# EAGLE schematic odrs (EAGLE 9.6.0)
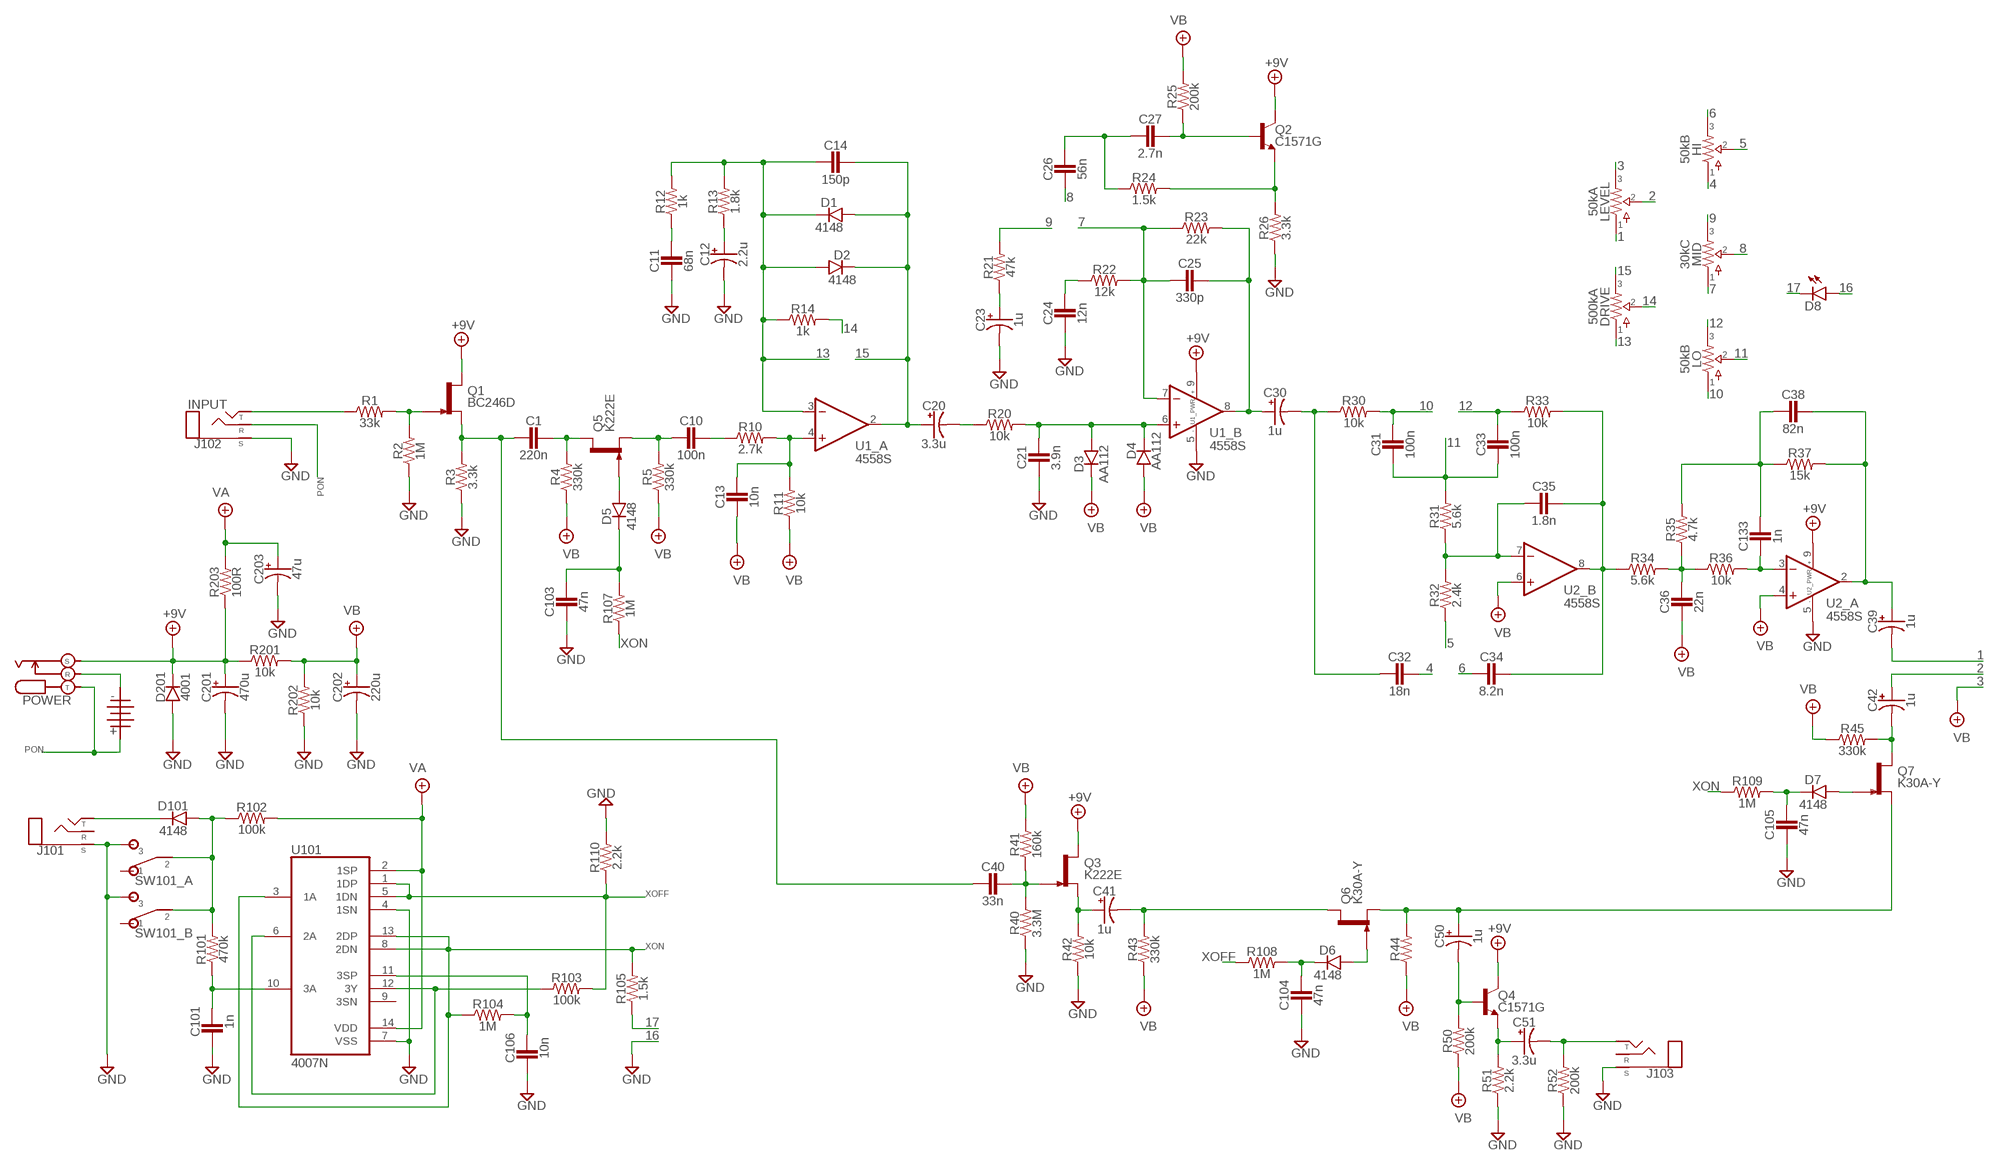
[diagram p0: schematic, sheet 1]

## Parts
1101  BATTERY  [TWO_PADS]
C1  220n  CER/FILMBOX.1  [BOX_SMALL]
C10  100n  CER/FILMBOX.1  [BOX_SMALL]
C11  68n  CER/FILMBOX.1  [BOX_SMALL]
C12  2.2u  0500  [050_020]
C13  10n  CER/FILMBOX.1  [BOX_SMALL]
C14  150p  CER/FILMBOX.1  [BOX_SMALL]
C20  3.3u  0500  [050_020]
C21  3.9n  CER/FILMBOX.1  [BOX_SMALL]
C23  1u  0500  [050_020]
C24  12n  CER/FILMBOX.1  [BOX_SMALL]
C25  330p  CER/FILMBOX.1  [BOX_SMALL]
C26  56n  CER/FILMBOX.1  [BOX_SMALL]
C27  2.7n  CER/FILMBOX.1  [BOX_SMALL]
C30  1u  0500  [050_020]
C31  100n  CER/FILMBOX.1  [BOX_SMALL]
C32  18n  CER/FILMBOX.1  [BOX_SMALL]
C33  100n  CER/FILMBOX.1  [BOX_SMALL]
C34  8.2n  CER/FILMBOX.1  [BOX_SMALL]
C35  1.8n  CER/FILMBOX.1  [BOX_SMALL]
C36  22n  CER/FILMBOX.1  [BOX_SMALL]
C38  82n  CER/FILMBOX.1  [BOX_SMALL]
C39  1u  0500  [050_020]
C40  33n  CER/FILMBOX.1  [BOX_SMALL]
C41  1u  0500  [050_020]
C42  1u  0500  [050_020]
C50  1u  0500  [050_020]
C51  3.3u  0500  [050_020]
C101  1n  CER/FILMBOX.1  [BOX_SMALL]
C103  47n  CER/FILMBOX.1  [BOX_SMALL]
C104  47n  CER/FILMBOX.1  [BOX_SMALL]
C105  47n  CER/FILMBOX.1  [BOX_SMALL]
C106  10n  CER/FILMBOX.1  [BOX_SMALL]
C133  1n  CER/FILMBOX.1  [BOX_SMALL]
C201  470u  0400  [040_020]
C202  220u  0400  [040_020]
C203  47u  0400  [040_020]
D1  4148  DO35.2  [DO35-2]
D2  4148  DO35.2  [DO35-2]
D3  AA112  DO35.2  [DO35-2]
D4  AA112  DO35.2  [DO35-2]
D5  4148  DO35.2  [DO35-2]
D6  4148  DO35.2  [DO35-2]
D7  4148  DO35.2  [DO35-2]
D8  LED  [3MM_D]
D101  4148  DO35.2  [DO35-2]
D201  4001  DO35.2  [DO35-2]
DRIVE  500kA  POTS16MM  [16MM]
HI  50kB  POTS16MM  [16MM]
J101  STEREO3PADS  [THREEPADS]
J102  INPUT  STEREO3PADS  [THREEPADS]
J103  STEREO  [STEREO_PCB]
LEVEL  50kA  POTS16MM  [16MM]
LO  50kB  POTS16MM  [16MM]
MID  30kC  POTS16MM  [16MM]
POWER  POWER  DC_KOBICONN  [DC_KOBICONN]
Q1  BC246D  2SK170  [TO92-]
Q2  C1571G  2N3904  [TO92-]
Q3  K222E  2SK170  [TO92-]
Q4  C1571G  2N3904  [TO92-]
Q5  K222E  2SK170  [TO92-]
Q6  K30A-Y  2SK170  [TO92-]
Q7  K30A-Y  2SK170  [TO92-]
R1  33k  R_.3B  [R0207/3]
R2  1M  R_.3B  [R0207/3]
R3  3.3k  R_.3B  [R0207/3]
R4  330k  R_.3B  [R0207/3]
R5  330k  R_.3B  [R0207/3]
R10  2.7k  R_.3B  [R0207/3]
R11  10k  R_.3B  [R0207/3]
R12  1k  R_.3B  [R0207/3]
R13  1.8k  R_.3B  [R0207/3]
R14  1k  R_.3B  [R0207/3]
R20  10k  R_.3B  [R0207/3]
R21  47k  R_.3B  [R0207/3]
R22  12k  R_.3B  [R0207/3]
R23  22k  R_.3B  [R0207/3]
R24  1.5k  R_.3B  [R0207/3]
R25  200k  R_.3B  [R0207/3]
R26  3.3k  R_.3B  [R0207/3]
R30  10k  R_.3B  [R0207/3]
R31  5.6k  R_.3B  [R0207/3]
R32  2.4k  R_.3B  [R0207/3]
R33  10k  R_.3B  [R0207/3]
R34  5.6k  R_.3B  [R0207/3]
R35  4.7k  R_.3B  [R0207/3]
R36  10k  R_.3B  [R0207/3]
R37  15k  R_.3B  [R0207/3]
R40  3.3M  R_.3B  [R0207/3]
R41  160k  R_.3B  [R0207/3]
R42  10k  R_.3B  [R0207/3]
R43  330k  R_.3B  [R0207/3]
R44  R_.3B  [R0207/3]
R45  330k  R_.3B  [R0207/3]
R50  200k  R_.3B  [R0207/3]
R51  2.2k  R_.3B  [R0207/3]
R52  200k  R_.3B  [R0207/3]
R101  470k  R_.3B  [R0207/3]
R102  100k  R_.3B  [R0207/3]
R103  100k  R_.3B  [R0207/3]
R104  1M  R_.3B  [R0207/3]
R105  1.5k  R_.3B  [R0207/3]
R107  1M  R_.3B  [R0207/3]
R108  1M  R_.3B  [R0207/3]
R109  1M  R_.3B  [R0207/3]
R110  2.2k  R_.3B  [R0207/3]
R201  10k  R_.3B  [R0207/3]
R202  10k  R_.3B  [R0207/3]
R203  100R  R_.3B  [R0207/3]
SW101  DPDT  [DPDT]
U1  4558S  DUAL  [SIL09]
U2  4558S  DUAL  [SIL09]
U101  4007N  [DIL14]

## Nets
1: C39.-
2: C42.+
4: C32.1 HI.1
5: HI.2 R32.1
6: C34.2 HI.3
7: C25.2 MID.1 R22.2 R23.1 U1.7(_B:-IN)
8: C26.2 MID.2
9: MID.3 R21.2
10: C31.1 LO.1 R30.2
11: C31.2 C33.2 LO.2 R31.2
12: C33.1 LO.3 R33.1
13: C14.2 D1.C D2.A DRIVE.1 R12.2 R13.2 R14.1 U1.3(_A:-IN)
14: DRIVE.2 R14.2
15: C14.1 C20.+ D1.A D2.C DRIVE.3 U1.2(_A:OUT)
16: D8.ANODE(A) ; supply symbol labelled GND
17: D8.P$1(C) R105.1
+9V: C201.+ D201.C POWER.S Q1.3(D) Q2.1(C) Q3.3(D) Q4.1(C) R201.1 R203.1 U1.9(_PWR:V+) U2.9(_PWR:V+)
GND: C11.2 C12.- C21.2 C23.- C24.2 C101.2 C103.2 C104.2 C105.2 C106.2 C201.- C202.- C203.- D201.A J101.SLEEVE(S) J102.SLEEVE(S) J103.P$1(S) R2.1 R3.1 R26.1 R40.1 R42.1 R51.1 R52.1 R110.2 R202.1 SW101.A3 SW101.B3 U1.5(_PWR:V-) U2.5(_PWR:V-) U101.4(1SN) U101.7(VSS)
N$1: J102.TIP(T) R1.1
N$2: Q1.2(G) R1.2 R2.2
N$3: C1.2 C40.2 Q1.1(S) R3.2
N$4: C1.1 Q5.3(D) R4.2
N$5: C10.2 Q5.1(S) R5.2
N$6: D5.A Q5.2(G)
N$7: C103.1 D5.C R107.2
N$10: C10.1 R10.1
N$11: C13.1 R10.2 R11.2 U1.4(_A:+IN)
N$14: C20.- R20.1
N$15: C21.1 D3.A D4.C R20.2 U1.6(_B:+IN)
N$16: C12.+ R13.1
N$17: C11.1 R12.1
N$19: C25.1 C30.+ R23.2 U1.8(_B:OUT)
N$20: C24.1 R22.1
N$21: C23.+ R21.1
N$24: C26.1 C27.2 R24.1
N$25: C27.1 Q2.2(B) R25.1
N$26: Q2.3(E) R24.2 R26.2
N$27: 1101.S POWER.R
N$28: J102.RING(R)
N$29: C30.- C32.2 R30.1
N$30: C34.1 C35.1 R33.2 R34.1 U2.8(_B:OUT)
N$34: C35.2 R31.1 R32.2 U2.7(_B:-IN)
N$38: C36.1 R34.2 R35.1 R36.1
N$39: C133.2 R36.2 U2.3(_A:-IN)
N$40: C38.2 C133.1 R35.2 R37.1
N$41: C38.1 C39.+ R37.2 U2.2(_A:OUT)
N$44: C42.- Q7.3(D) R45.2
N$45: C50.+ Q6.1(S) Q7.1(S) R44.2
N$46: D7.A Q7.2(G)
N$47: C105.1 D7.C R109.2
N$49: D6.A Q6.2(G)
N$50: C104.1 D6.C R108.2
N$53: R103.1 U101.6(2A) U101.12(3Y)
N$54: C106.1 R104.2 U101.11(3SP)
N$55: D101.C J101.TIP(T)
N$56: D101.A R101.2 R102.1 SW101.A2 SW101.B2
N$57: C101.1 R101.1 U101.10(3A)
N$58: C41.- Q6.3(D) R43.2
N$59: C41.+ Q3.1(S) R42.2
N$60: C40.1 Q3.2(G) R40.2 R41.1
N$61: C50.- Q4.2(B) R50.2
N$62: C51.+ Q4.3(E) R51.2
N$63: C51.- J103.P$3(T) R52.2
N$64: LEVEL.1
N$65: LEVEL.3
N$66: LEVEL.2
PON: 1101.T POWER.T
VA: C203.+ R102.2 R203.2 U101.2(1SP) U101.14(VDD)
VB: C13.2 C36.2 C202.+ D3.C D4.A R4.1 R5.1 R11.1 R25.2 R41.2 R43.1 R44.1 R45.1 R50.1 R201.2 R202.2 U2.4(_A:+IN) U2.6(_B:+IN)
XOFF: R103.2 R108.1 R110.1 U101.1(1DP) U101.5(1DN)
XON: R104.1 R105.2 R107.1 R109.1 U101.3(1A) U101.8(2DN) U101.13(2DP)
Unconnected: J101.RING(R) J103.P$2(R) SW101.A1 SW101.B1 U101.9(3SN)

## Library data of the parts
1101 = pedals-jacks:BATTERY
C1 C10 C11 C13 C14 C21 C24-C27 C31-C36 C38 C40 C101 C103-C106 C133 = pedals-capacitors-film:CER/FILM: 47 - 120pF Xicon Ceramic Disc 2.5mm lead spacing
C12 C20 C23 C30 C39 C41 C42 C50 C51 = pedals-capacitors-elec:050
C201-C203 = pedals-capacitors-elec:040
D1-D7 D101 D201 = pedals-diodes:DO35: DO-35 Package Diodes: 1N914
D8 = pedals-diodes:LED
DRIVE HI LEVEL LO MID = pedals-potentiometers:POTS
J101-J103 = pedals-jacks:STEREO
POWER = pedals-jacks:DC_KOBICONN
Q1 Q3 Q5-Q7 = pedals-transistors:2SK170
Q2 Q4 = pedals-transistors:2N3904: NPN Transistor
R1-R5 R10-R14 R20-R26 R30-R37 R40-R45 R50-R52 R101-R105 R107-R110 R201-R203 = pedals-resistors:R_
SW101 = pedals-switches:DPDT
U1 U2 = pedals-integrated circuits:DUAL: OP AMP
U101 = 40xx:4007: Dual COMPLIMENTARY PAIR plus INVERTER